# Altium schematic sheet power.SchDoc
size A4; SheetNumber: 3; SheetTotal: 3
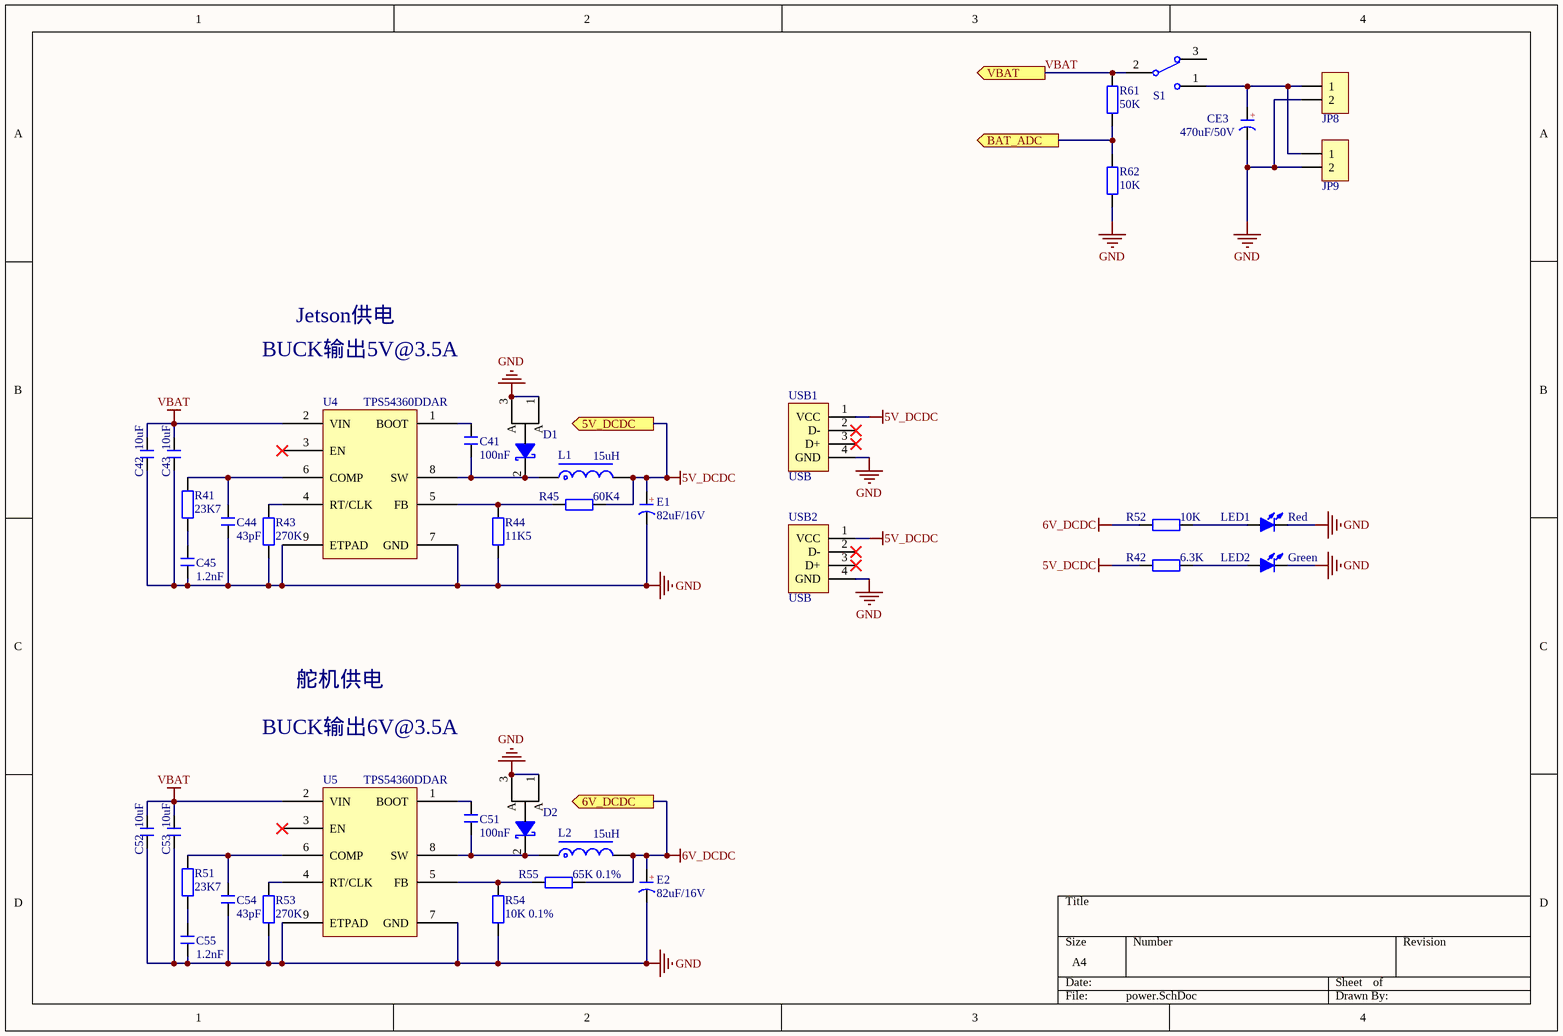
[diagram p0: power.SchDoc]

## Parts
C41  100nF  [C 0402_M]
C42  10uF  [C 2220_M]
C43  10uF  [C 2220_M]
C44  43pF  [C 0402_M]
C45  1.2nF  [C 0402_M]
C51  100nF  [C 0402_M]
C52  10uF  [C 2220_M]
C53  10uF  [C 2220_M]
C54  43pF  [C 0402_M]
C55  1.2nF  [C 0402_M]
CE3  470uF/50V  [CAP 5.0*10*16]
D1  50WQ10FNPBF  [D-PAK]  (value not drawn)
D2  50WQ10FNPBF  [D-PAK]  (value not drawn)
E1  82uF/16V  [CM C(5*5.4)]
E2  82uF/16V  [CM C(5*5.4)]
JP8  HDR-1X2  [TX60-LI-S]  (value not drawn)
JP9  HDR-1X2  [TX60-LI-S]  (value not drawn)
L1  15uH  [CDRH127]
L2  15uH  [CDRH127]
LED1  Red  [LED 1206R]
LED2  Green  [LED 1206G]
R41  23K7  [R 0402_M]
R42  6.3K  [R 0603_M]
R43  270K  [R 0603_M]
R44  11K5  [R 0603_M]
R45  60K4  [R 0402_M]
R51  23K7  [R 0402_M]
R52  10K  [R 0402_M]
R53  270K  [R 0603_M]
R54  10K 0.1%  [R 0603_M]
R55  65K 0.1%  [R 0402_M]
R61  50K  [R 0402_M]
R62  10K  [R 0402_M]
S1  SW-SPDT  [SS12D10]  (value not drawn)
U4  TPS54360DDAR  [SOP127P600X170_HS-9N]
U5  TPS54360DDAR  [SOP127P600X170_HS-9N]
USB1  USB  [USB-A/S_B]
USB2  USB  [USB-A/S_B]

## Ports
5V_DCDC (out), 6V_DCDC (out), BAT_ADC (out), VBAT (out)

## Nets
5V_DCDC: E1.1(A) L1.2 R42.1 R45.2 USB1.1(VCC) USB2.1(VCC) ; port 5V_DCDC
6V_DCDC: E2.1(A) L2.2 R52.1 R55.2 ; port 6V_DCDC
GND: C42.1 C43.1 C44.1 C45.1 C52.1 C53.1 C54.1 C55.1 CE3.2(K) D1.1(A) D1.3(A) D2.1(A) D2.3(A) E1.2(K) E2.2(K) JP8.2 JP9.2 LED1.2(K) LED2.2(K) R43.1 R44.2 R53.1 R54.2 R62.1 U4.7(GND) U4.9(ETPAD) U5.7(GND) U5.9(ETPAD) USB1.4(GND) USB2.4(GND)
VBAT: C42.2 C43.2 C52.2 C53.2 R61.2 S1.2 U4.2(VIN) U5.2(VIN) ; port VBAT
BAT_ADC: R61.1 R62.2 ; port BAT_ADC
NetC41_1: C41.1 D1.2(K) L1.1 U4.8(SW)
NetC41_2: C41.2 U4.1(BOOT)
NetC44_2: C44.2 R41.2 U4.6(COMP)
NetC45_2: C45.2 R41.1
NetC51_1: C51.1 D2.2(K) L2.1 U5.8(SW)
NetC51_2: C51.2 U5.1(BOOT)
NetC54_2: C54.2 R51.2 U5.6(COMP)
NetC55_2: C55.2 R51.1
NetCE3_1: CE3.1(A) JP8.1 JP9.1 S1.1
NetLED1_1: LED1.1(A) R52.2
NetLED2_1: LED2.1(A) R42.2
NetR43_2: R43.2 U4.4(RT/CLK)
NetR44_1: R44.1 R45.1 U4.5(FB)
NetR53_2: R53.2 U5.4(RT/CLK)
NetR54_1: R54.1 R55.1 U5.5(FB)

Not connected (* = marked no-connect by the designer): S1 3; U4 3(EN)*; U5 3(EN)*; USB1 2(D-)* 3(D+)*; USB2 2(D-)* 3(D+)*

## Notes on the sheet
- BUCK输出5V@3.5A
- Jetson供电
- 舵机供电
- BUCK输出6V@3.5A
- (in symbol CE) +
- (in symbol CE_SMD_82uF_16V) +

## Library data of the parts
C41 C51 = C_100nF_0402: MuRata GRM155R71C104KA88D Cap: 100 nF  Total Derated Cap: 74 nF  VDC: 16 V  ESR: 1 mΩ  Package: 0402
C42 C43 C52 C53 = C_10uF_100V_2220: TDK C5750X7S2A106M230KB Cap: 10 µF  Total Derated Cap: 6.4 µF  VDC: 100 V  ESR: 5 mΩ  Package:
C44 C54 = C_43pF_0402: MuRata GRM1555C1H430JA01D Cap: 43 pF  Total Derated Cap: 43 pF  VDC: 50 V  ESR: 1 mΩ  Package: 0402
C45 C55 = C_1.2nF_0402: MuRata GRM155R71H122KA01D Cap: 1.2 nF  Total Derated Cap: 1.2 nF  VDC: 50 V  ESR: 1 mΩ  Package: 0402
CE3 = CE: 直插电解电容
D1 D2 = Diode Schottky_100V_5.5A: Vishay-Semiconductor 50WQ10FNPBF Type: Schottky  VRRM: 100 V  Io: 5.5 A; Imax: 500mA; Published: 8-Jun-2000; Revision: July-2002: Re-released for DXP Platform.; Publisher: Altium Limited; Price(RMB): 0.000
E1 E2 = CE_SMD_82uF_16V: Panasonic 16SVPF82M Cap: 82 µF  Total Derated Cap: 82 µF  VDC: 16 V  ESR: 27 mΩ  Package: 5x5.9
JP8 JP9 = Header 2: 2P接插件
L1 L2 = L-CDRH_15uH_5.65A: 功率屏蔽电感Sumida CDRH127/LDNP-150MC L: 15 µH  DCR: 26.4 mΩ  IDC: 5.65 A; BOM名称: 功率屏蔽电感; 版权归属: 封装库来自淘宝 ID：黄晶宝石; 联系售后: https://shop463601444.taobao.com
LED1 LED2 = LED-SMD: 贴片LED; 版权归属: 封装库来自淘宝 ID：黄晶宝石; BOM名称: 贴片LED; 学习资源: https://shop463601444.taobao.com
R41 R51 = R_23K7_0402_1%: Yageo AC0402FR-0723K7L Resistance: 23.7 kΩ  Tolerance: 1.0%  Power: 63 mW
R42 R52 R61 R62 = R_10K_0603: 贴片电阻
R43 R53 = R_270K_0603_1%: Yageo RC0603FR-07270KL Resistance: 270 kΩ  Tolerance: 1.0%  Power: 100 mW
R44 = R_11K5_0603_1%: Yageo RC0603FR-0711K5L Resistance: 11.5 kΩ  Tolerance: 1.0%  Power: 100 mW
R45 = R_60K4_0402_1%: Vishay-Dale CRCW040260K4FKED Resistance: 60.4 kΩ Tolerance: 1.0%  Power: 63 mW
R54 R55 = R: 贴片电阻
S1 = SW-SPDT: 单刀双掷开关 3脚船型、钮子、拨动开关 SPDT Subminiature Toggle Switch; Published: 24-Mar-1999; Publisher: Altium Limited; Price(RMB): 0.000
USB1 USB2 = USB-A/S: USB-A型母接口